# Altium schematic sheet Bus.SchDoc
size A4; SheetNumber: 8; SheetTotal: 11
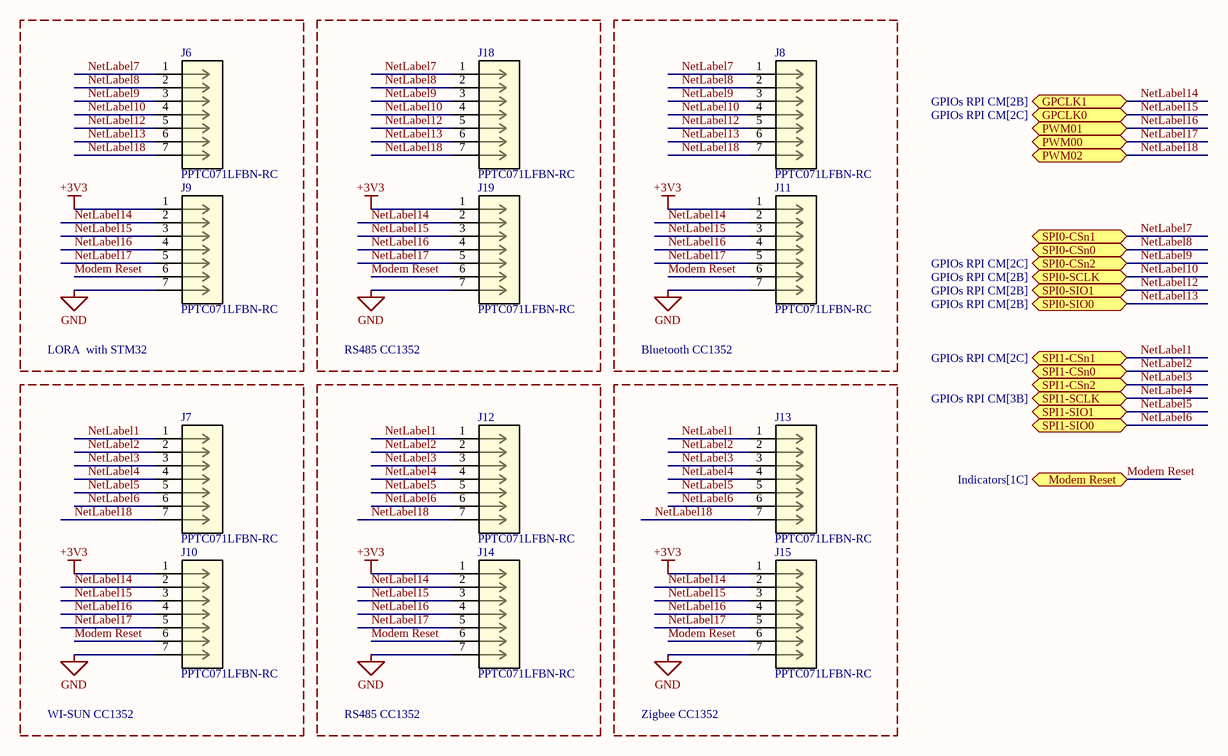
[diagram p0: Bus.SchDoc]

## Parts
J6  PPTC071LFBN-RC  [CONN_xPxC071LFBN-RC_SUL]
J7  PPTC071LFBN-RC  [CONN_xPxC071LFBN-RC_SUL]
J8  PPTC071LFBN-RC  [CONN_xPxC071LFBN-RC_SUL]
J9  PPTC071LFBN-RC  [CONN_xPxC071LFBN-RC_SUL]
J10  PPTC071LFBN-RC  [CONN_xPxC071LFBN-RC_SUL]
J11  PPTC071LFBN-RC  [CONN_xPxC071LFBN-RC_SUL]
J12  PPTC071LFBN-RC  [CONN_xPxC071LFBN-RC_SUL]
J13  PPTC071LFBN-RC  [CONN_xPxC071LFBN-RC_SUL]
J14  PPTC071LFBN-RC  [CONN_xPxC071LFBN-RC_SUL]
J15  PPTC071LFBN-RC  [CONN_xPxC071LFBN-RC_SUL]
J18  PPTC071LFBN-RC  [CONN_xPxC071LFBN-RC_SUL]
J19  PPTC071LFBN-RC  [CONN_xPxC071LFBN-RC_SUL]

## Blocks framed on the sheet
LORA  with STM32: J6 J9
RS485 CC1352: J18 J19
Bluetooth CC1352: J8 J11
WI-SUN CC1352: J7 J10
RS485 CC1352: J12 J14
Zigbee CC1352: J13 J15

## Ports
GPCLK0 (bidir, see GPIOs RPI CM[2C]), GPCLK1 (bidir, see GPIOs RPI CM[2B]), Modem Reset (bidir, see Indicators[1C]), PWM00 (bidir), PWM01 (bidir), PWM02 (bidir), SPI0-CSn0 (bidir), SPI0-CSn1 (bidir), SPI0-CSn2 (bidir, see GPIOs RPI CM[2C]), SPI0-SCLK (bidir, see GPIOs RPI CM[2B]), SPI0-SIO0 (bidir, see GPIOs RPI CM[2B]), SPI0-SIO1 (bidir, see GPIOs RPI CM[2B]), SPI1-CSn0 (bidir), SPI1-CSn1 (bidir, see GPIOs RPI CM[2C]), SPI1-CSn2 (bidir), SPI1-SCLK (bidir, see GPIOs RPI CM[3B]), SPI1-SIO0 (bidir), SPI1-SIO1 (bidir)

## Nets
+3V3: J9.1 J10.1 J11.1 J14.1 J15.1 J19.1
GND: J9.7 J10.7 J11.7 J14.7 J15.7 J19.7
Modem Reset: J9.6 J10.6 J11.6 J14.6 J15.6 J19.6 ; port Modem Reset
NetLabel1: J7.1 J12.1 J13.1 ; port SPI1-CSn1
NetLabel2: J7.2 J12.2 J13.2 ; port SPI1-CSn0
NetLabel3: J7.3 J12.3 J13.3 ; port SPI1-CSn2
NetLabel4: J7.4 J12.4 J13.4 ; port SPI1-SCLK
NetLabel5: J7.5 J12.5 J13.5 ; port SPI1-SIO1
NetLabel6: J7.6 J12.6 J13.6 ; port SPI1-SIO0
NetLabel7: J6.1 J8.1 J18.1 ; port SPI0-CSn1
NetLabel8: J6.2 J8.2 J18.2 ; port SPI0-CSn0
NetLabel9: J6.3 J8.3 J18.3 ; port SPI0-CSn2
NetLabel10: J6.4 J8.4 J18.4 ; port SPI0-SCLK
NetLabel12: J6.5 J8.5 J18.5 ; port SPI0-SIO1
NetLabel13: J6.6 J8.6 J18.6 ; port SPI0-SIO0
NetLabel14: J9.2 J10.2 J11.2 J14.2 J15.2 J19.2 ; port GPCLK1
NetLabel15: J9.3 J10.3 J11.3 J14.3 J15.3 J19.3 ; port GPCLK0
NetLabel16: J9.4 J10.4 J11.4 J14.4 J15.4 J19.4 ; port PWM01
NetLabel17: J9.5 J10.5 J11.5 J14.5 J15.5 J19.5 ; port PWM00
NetLabel18: J6.7 J7.7 J8.7 J12.7 J13.7 J18.7 ; port PWM02

## Library data of the parts
J6-J15 J18 J19 = PPTC071LFBN-RC: No Description Available; Mfr_Name: Sullins; RefDes: RefDes; Type: Type